# Altium schematic sheet FMC_SDR_top.SchDoc: FMC SDR Transceiver Board
size 420 x 297 mm; CheckedBy: -; CompanyName: CERN; DrawnBy: DrawnBy; Organization: CERN; Address1: European Organization for Nuclear Research; Address2: CH-1211 Genčve 23 - Switzerland; Revision: -; SheetNumber: -; SheetTotal: -; EDA_Number: EDA-XXXXX-VX-X; Projet: -; ModifiedBy: -; CreateDate: XX/XX/XXXX; CheckedDate: -; Title2: Top Schematic; DivGrp: TE/MPE; Designer: Designer; ModifiedDate: -
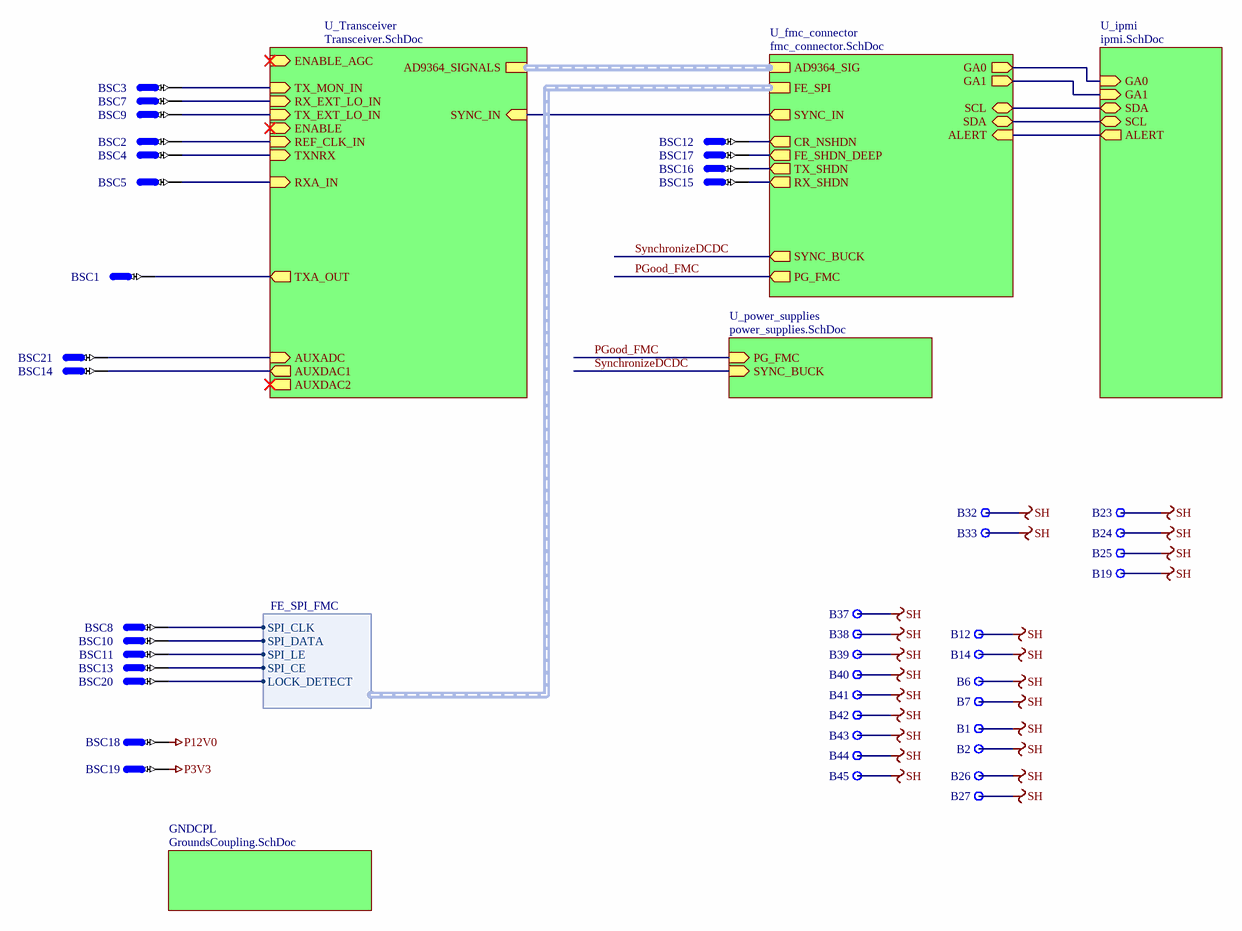
[diagram p0: FMC_SDR_top.SchDoc]

## Parts
B1  Plated Hole  [MTG240_400]  (value not drawn)  (no BOM)
B2  Plated Hole  [MTG240_400]  (value not drawn)  (no BOM)
B6  Plated Hole  [MTG240_400]  (value not drawn)  (no BOM)
B7  Plated Hole  [MTG240_400]  (value not drawn)  (no BOM)
B12  Plated Hole  [MTG240_400]  (value not drawn)  (no BOM)
B14  Plated Hole  [MTG240_400]  (value not drawn)  (no BOM)
B19  Plated Hole  [MTG270_500]  (value not drawn)
B23  Plated Hole  [MTG270_500]  (value not drawn)
B24  Plated Hole  [MTG270_500]  (value not drawn)
B25  Plated Hole  [MTG270_500]  (value not drawn)
B26  Plated Hole  [MTG240_400]  (value not drawn)  (no BOM)
B27  Plated Hole  [MTG240_400]  (value not drawn)  (no BOM)
B32  Plated Hole  [MTG240_400]  (value not drawn)  (no BOM)
B33  Plated Hole  [MTG240_400]  (value not drawn)  (no BOM)
B37  Plated Hole  [MTG240_400]  (value not drawn)  (no BOM)
B38  Plated Hole  [MTG240_400]  (value not drawn)  (no BOM)
B39  Plated Hole  [MTG240_400]  (value not drawn)  (no BOM)
B40  Plated Hole  [MTG240_400]  (value not drawn)  (no BOM)
B41  Plated Hole  [MTG240_400]  (value not drawn)  (no BOM)
B42  Plated Hole  [MTG240_400]  (value not drawn)  (no BOM)
B43  Plated Hole  [MTG240_400]  (value not drawn)  (no BOM)
B44  Plated Hole  [MTG240_400]  (value not drawn)  (no BOM)
B45  Plated Hole  [MTG240_400]  (value not drawn)  (no BOM)
BSC1  0603 Female  [PCB_CONN_0603F]  (value not drawn)
BSC2  0603 Female  [PCB_CONN_0603F]  (value not drawn)
BSC3  0603 Female  [PCB_CONN_0603F]  (value not drawn)
BSC4  0603 Female  [PCB_CONN_0603F]  (value not drawn)
BSC5  0603 Female  [PCB_CONN_0603F]  (value not drawn)
BSC7  0603 Female  [PCB_CONN_0603F]  (value not drawn)
BSC8  0603 Female  [PCB_CONN_0603F]  (value not drawn)
BSC9  0603 Female  [PCB_CONN_0603F]  (value not drawn)
BSC10  0603 Female  [PCB_CONN_0603F]  (value not drawn)
BSC11  0603 Female  [PCB_CONN_0603F]  (value not drawn)
BSC12  0603 Female  [PCB_CONN_0603F]  (value not drawn)
BSC13  0603 Female  [PCB_CONN_0603F]  (value not drawn)
BSC14  0603 Female  [PCB_CONN_0603F]  (value not drawn)
BSC15  0603 Female  [PCB_CONN_0603F]  (value not drawn)
BSC16  0603 Female  [PCB_CONN_0603F]  (value not drawn)
BSC17  0603 Female  [PCB_CONN_0603F]  (value not drawn)
BSC18  1206 Female  [PCB_CONN_1206F]  (value not drawn)
BSC19  1206 Female  [PCB_CONN_1206F]  (value not drawn)
BSC20  0603 Female  [PCB_CONN_0603F]  (value not drawn)
BSC21  0603 Female  [PCB_CONN_0603F]  (value not drawn)

## Sub-sheets
GNDCPL = GroundsCoupling.SchDoc: no entries
U_fmc_connector = fmc_connector.SchDoc: SCL (bidir), SDA (bidir), GA0 (out), GA1 (out), PG_FMC (out), ALERT (in), SYNC_IN (out), SYNC_BUCK (out), RX_SHDN (out), TX_SHDN (out), FE_SPI (harness FE_SPI_FMC), FE_SHDN_DEEP (out), CR_NSHDN (out), AD9364_SIG (harness AD9364_SIG)
U_ipmi = ipmi.SchDoc: GA0 (in), GA1 (in), SDA (bidir), SCL (bidir), ALERT (out)
U_power_supplies = power_supplies.SchDoc: PG_FMC (in), SYNC_BUCK (in)
U_Transceiver = Transceiver.SchDoc: TX_MON_IN (in), RX_EXT_LO_IN (in), SYNC_IN (in), ENABLE_AGC (in), AD9364_SIGNALS (harness AD9364_SIG), TX_EXT_LO_IN (in), ENABLE (in), TXNRX (in), REF_CLK_IN (in), RXA_IN (in), TXA_OUT (out), AUXDAC2 (out), AUXADC (in), AUXDAC1 (out)

## Harnesses
FE_SPI_FMC: SPI_CLK, SPI_DATA, SPI_LE, SPI_CE, LOCK_DETECT

## Nets
P3V3: BSC19.1
P12V0: BSC18.1
SH: B1.1 B2.1 B6.1 B7.1 B12.1 B14.1 B19.1 B23.1 B24.1 B25.1 B26.1 B27.1 B32.1 B33.1 B37.1 B38.1 B39.1 B40.1 B41.1 B42.1 B43.1 B44.1 B45.1
PGood_FMC: sheet U_power_supplies/PG_FMC, sheet U_fmc_connector/PG_FMC
SynchronizeDCDC: sheet U_power_supplies/SYNC_BUCK, sheet U_fmc_connector/SYNC_BUCK
NetBSC1_1: BSC1.1 ; sheet U_Transceiver/TXA_OUT
NetBSC2_1: BSC2.1 ; sheet U_Transceiver/REF_CLK_IN
NetBSC3_1: BSC3.1 ; sheet U_Transceiver/TX_MON_IN
NetBSC4_1: BSC4.1 ; sheet U_Transceiver/TXNRX
NetBSC5_1: BSC5.1 ; sheet U_Transceiver/RXA_IN
NetBSC7_1: BSC7.1 ; sheet U_Transceiver/RX_EXT_LO_IN
NetBSC8_1: BSC8.1 ; sheet U_fmc_connector/FE_SPI.SPI_CLK
NetBSC9_1: BSC9.1 ; sheet U_Transceiver/TX_EXT_LO_IN
NetBSC10_1: BSC10.1 ; sheet U_fmc_connector/FE_SPI.SPI_DATA
NetBSC11_1: BSC11.1 ; sheet U_fmc_connector/FE_SPI.SPI_LE
NetBSC12_1: BSC12.1 ; sheet U_fmc_connector/CR_NSHDN
NetBSC13_1: BSC13.1 ; sheet U_fmc_connector/FE_SPI.SPI_CE
NetBSC14_1: BSC14.1 ; sheet U_Transceiver/AUXDAC1
NetBSC15_1: BSC15.1 ; sheet U_fmc_connector/RX_SHDN
NetBSC16_1: BSC16.1 ; sheet U_fmc_connector/TX_SHDN
NetBSC17_1: BSC17.1 ; sheet U_fmc_connector/FE_SHDN_DEEP
NetBSC20_1: BSC20.1 ; sheet U_fmc_connector/FE_SPI.LOCK_DETECT
NetBSC21_1: BSC21.1 ; sheet U_Transceiver/AUXADC
(unnamed): sheet U_ipmi/GA0, sheet U_fmc_connector/GA0
(unnamed): sheet U_ipmi/GA1, sheet U_fmc_connector/GA1
(unnamed): sheet U_ipmi/SDA, sheet U_fmc_connector/SCL
(unnamed): sheet U_ipmi/SCL, sheet U_fmc_connector/SDA
(unnamed): sheet U_ipmi/ALERT, sheet U_fmc_connector/ALERT
(unnamed): sheet U_Transceiver/SYNC_IN, sheet U_fmc_connector/SYNC_IN

## Buses and harness runs
harness sheet U_fmc_connector/AD9364_SIG = sheet U_Transceiver/AD9364_SIGNALS

## Notes on the sheet
- Project/Equipment
- Document
- Designer
- Drawn by
- Check.by
- File
- Last Mod.
- Print Date
- Sheet
- Size
- A3
- of
- Rev

## Library data of the parts
B1 B2 B6 B7 B12 B14 B26 B27 B32 B33 B37-B45 = PLATED_HOLE2.4_PAD4.0: Single Terminal Socket; Part Description: Plated Through Hole: Hole Dia.=2.4mm Pad Dia.=4.0mm; Mounted: No; Table: Pads; Part Number: PLATED_HOLE2.4_PAD4.0; Component Type: Standard (No BOM); Pin Count: 1; Family: Plated Hole; Socket: No; SMD: No; Status: None; ComponentHeight: 0mm; Author: CERN DEM JMW; CreateDate: 2011-10-10; LatestRevisionDate: 2011-10-10; PackageDescription: Plated Through Hole: Hole Dia.=2.4mm Pad Dia.=4.0mm
B19 B23-B25 = PLATED_HOLE2.7_PAD5.0: Single Terminal Socket; Part Description: Plated Through Hole: Hole Dia.=2.7mm Pad Dia.=5.0mm; Mounted: No; Part Number: PLATED_HOLE2.7_PAD5.0; Component Kind: Standard (No BOM); Component Type: Standard (No BOM); Pin Count: 1; Family: Plated Hole; Socket: No; SMD: No; Sense: No; Status: None; ComponentHeight: 0mm; HelpURL: Undefined; Author: CERN DEM JMW; CreateDate: 27/09/2011; LatestRevisionDate: 27/09/2011; PackageDescription: Plated Through Hole: Hole Dia.=2.7mm Pad Dia.=5.0mm
BSC1-BSC5 BSC7-BSC17 BSC20 BSC21 = 0603_female_BoardSolderConnector: Part Description: Board connection - soldered 0603 jumper; PressFit: No; Pin Count: 1; Socket: No; SMD: Yes; Sense: No; Status: None; System: Connector
BSC18 BSC19 = 1206_female_BoardSolderConnector: Part Description: Board connection - soldered 1206 jumper; PressFit: No; Pin Count: 1; Socket: No; SMD: Yes; Sense: No; Status: None; System: Connector